# EAGLE design CurrentSenseMXChip (EAGLE 9.3.2)
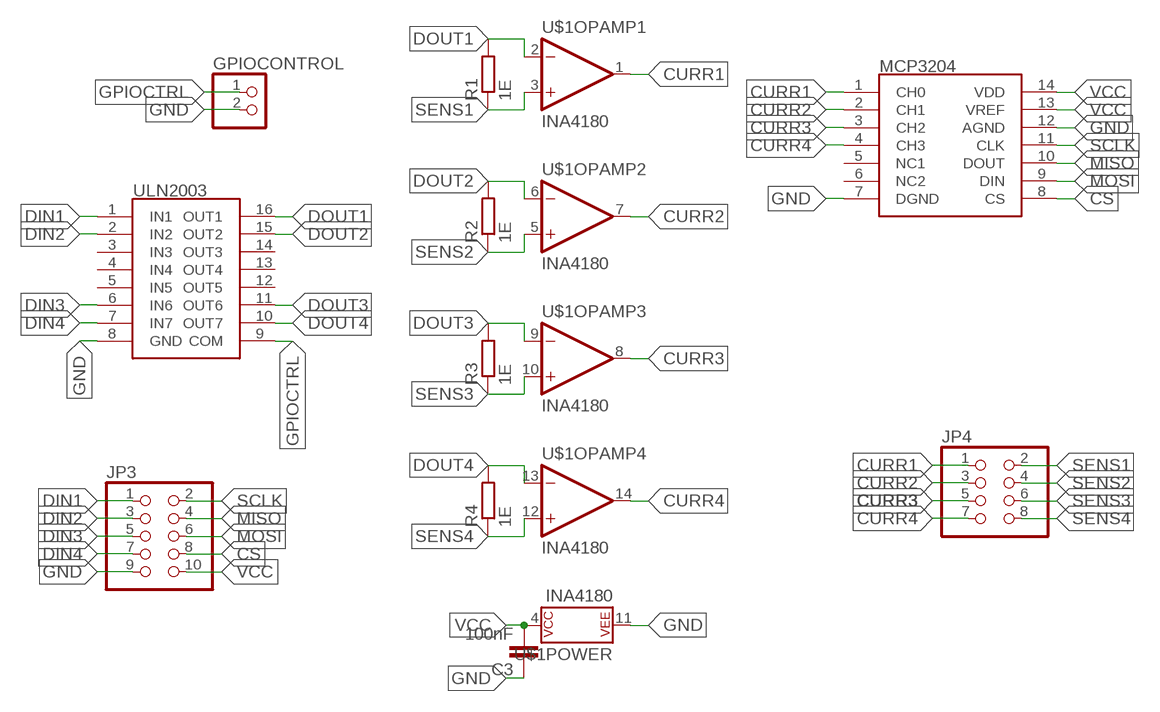
[diagram p0: schematic, sheet 1]

## Parts
C3  100nF  C-EUC1206  [C1206]
GPIOCONTROL  PINHD-1X2  [1X02]
JP3  PINHD-2X5  [2X05]
JP4  PINHD-2X4  [2X04]
R1  1E  R-EU_R1206  [R1206]
R2  1E  R-EU_R1206  [R1206]
R3  1E  R-EU_R1206  [R1206]
R4  1E  R-EU_R1206  [R1206]
U$1  INA4180  [TSSOP-14]
U$2  ULN2003  [SO16]
U$3  MCP3204  [TSSOP-14]

## Nets
CS: JP3.8 U$3.8(CS)
CURR1: JP4.1 U$1.1(OPAMP1:OUT) U$3.1(CH0)
CURR2: JP4.3 U$1.7(OPAMP2:OUT) U$3.2(CH1)
CURR3: JP4.5 U$1.8(OPAMP3:OUT) U$3.3(CH2)
CURR4: JP4.7 U$1.14(OPAMP4:OUT) U$3.4(CH3)
DIN1: JP3.1 U$2.1(IN1)
DIN2: JP3.3 U$2.2(IN2)
DIN3: JP3.5 U$2.6(IN6)
DIN4: JP3.7 U$2.7(IN7)
DOUT1: R1.2 U$1.2(OPAMP1:-IN) U$2.16(OUT1)
DOUT2: R2.2 U$1.6(OPAMP2:-IN) U$2.15(OUT2)
DOUT3: R3.2 U$1.9(OPAMP3:-IN) U$2.11(OUT6)
DOUT4: R4.2 U$1.13(OPAMP4:-IN) U$2.10(OUT7)
GND: C3.1 GPIOCONTROL.2 JP3.9 U$1.11(POWER:P$V-) U$2.8(GND) U$3.7(DGND) U$3.12(AGND)
GPIOCTRL: GPIOCONTROL.1 U$2.9(COM)
MISO: JP3.4 U$3.10(DOUT)
MOSI: JP3.6 U$3.9(DIN)
SCLK: JP3.2 U$3.11(CLK)
SENS1: JP4.2 R1.1 U$1.3(OPAMP1:+IN)
SENS2: JP4.4 R2.1 U$1.5(OPAMP2:+IN)
SENS3: JP4.6 R3.1 U$1.10(OPAMP3:+IN)
SENS4: JP4.8 R4.1 U$1.12(OPAMP4:+IN)
VCC: C3.2 JP3.10 U$1.4(POWER:P$V+) U$3.13(VREF) U$3.14(VDD)
Unconnected: U$2.3(IN3) U$2.4(IN4) U$2.5(IN5) U$2.12(OUT5) U$2.13(OUT4) U$2.14(OUT3) U$3.5(NC1) U$3.6(NC2)

## Library data of the parts
C3 = resistor:C-EU: CAPACITOR, European symbol
GPIOCONTROL = pinhead:PINHD-1X2: PIN HEADER
JP3 = pinhead:PINHD-2X5: PIN HEADER
JP4 = pinhead:PINHD-2X4: PIN HEADER
R1-R4 = resistor:R-EU_: RESISTOR, European symbol
U$1 = SparkFun-IC-Amplifiers:INA4180
U$2 = SparkFun-IC-Amplifiers:ULN2003
U$3 = SparkFun-IC-Amplifiers-1:MCP3204

## Board
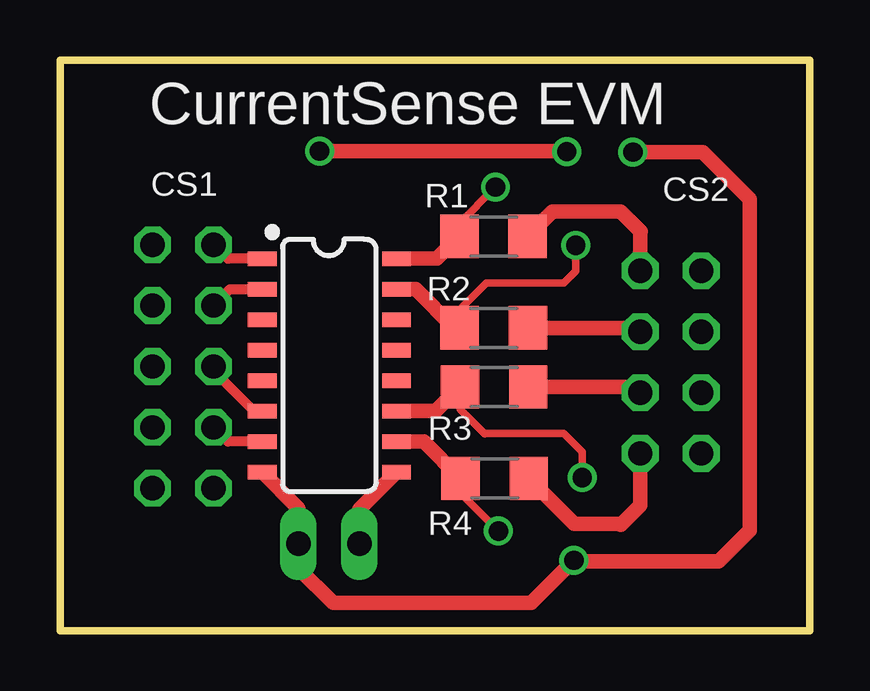
[diagram p1: board, top side]
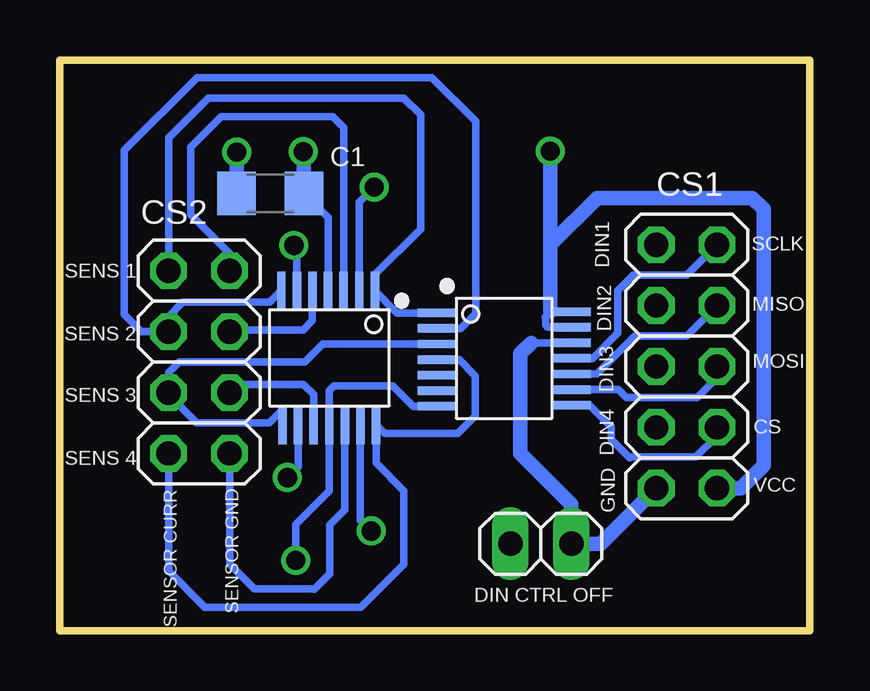
[diagram p2: board, bottom side, seen from below]

Size 31.24 x 23.81 mm. Coordinates in mm from the lower left corner, seen from the top.
Outline: 0,0.02 0,23.8 31.24,23.81 31.24,0 0,0
Copper layers (1*16): Top 0.035mm / dielectric 1.5mm / Bottom 0.035mm
Design rules "default *": minimum track width 8mil, minimum drill 8mil, track to track 24mil, track to pad 24mil, pad to pad 24mil, via to via 24mil, smd to smd 8mil, copper to edge 40mil, drill to drill 8mil, minimum pad ring 7mil, minimum via ring 8mil, stop-mask expansion 4mil, vias tented up to drill 0mil, thermal gap 10mil

### Footprints (pad centres in the part's own frame; a part is rotated, then mirrored left to right if it is on the bottom)
C1206 = smd 1.6 x 1.8: 1 -1.4,0; 2 1.4,0
1X02 = drill 1.016 long: 1 -1.27,0; 2 1.27,0
2X05 = drill 1.016 octagon: 1 -5.08,-1.27; 2 -5.08,1.27; 3 -2.54,-1.27; 4 -2.54,1.27; 5 0,-1.27; 6 0,1.27; 7 2.54,-1.27; 8 2.54,1.27; 9 5.08,-1.27; 10 5.08,1.27
2X04 = drill 1.016 octagon: 1 -3.81,-1.27; 2 -3.81,1.27; 3 -1.27,-1.27; 4 -1.27,1.27; 5 1.27,-1.27; 6 1.27,1.27; 7 3.81,-1.27; 8 3.81,1.27
R1206 = smd 1.6 x 1.803: 1 -1.422,0; 2 1.422,0
TSSOP-14 = smd 1.6 x 0.35: 1 -2.8,1.9; 2 -2.8,1.25; 3 -2.8,0.6; 4 -2.8,-0.05; 5 -2.8,-0.7; 6 -2.8,-1.35; 7 -2.8,-2; 8 2.8,-1.95; 9 2.8,-1.3; 10 2.8,-0.65; 11 2.8,0; 12 2.8,0.65; 13 2.8,1.3; 14 2.8,1.95
SO16 = smd 0.6 x 1.2: 1 -4.445,-2.8; 2 -3.175,-2.8; 3 -1.905,-2.8; 4 -0.635,-2.8; 5 0.635,-2.8; 6 1.905,-2.8; 7 3.175,-2.8; 8 4.445,-2.8; 9 4.445,2.8; 10 3.175,2.8; 11 1.905,2.8; 12 0.635,2.8; 13 -0.635,2.8; 14 -1.905,2.8; 15 -3.175,2.8; 16 -4.445,2.8

### Placement (x,y rotation side)
C3  22.48,18.25 0 bottom
GPIOCONTROL  11.2,3.64 0 bottom
JP3  5.13,11.03 270 bottom
JP4  25.45,11.21 270 bottom
R1  18.06,16.45 180 top
R2  18.07,12.64 180 top
R3  18.09,10.18 180 top
R4  18.11,6.36 180 top
U$1  20.02,11.39 270 bottom
U$2  11.22,11.08 270 top
U$3  12.73,11.37 0 bottom

### Tracks (layer width: path | path; a pad name or v marks a point on that pad's centre or on a via)
CS
  Bottom 0.305: JP3.8 3.86,8.14 4.75,7.25 7.47,7.25 7.5,7.23 8.27,8 8.27,8.51 9.18,9.42 U$3.8
CURR1
  Bottom 0.305: U$3.1 17.2,13.27 U$1.1 18.12,14.86 16.22,16.77 16.22,21.52 16.92,22.22 25.07,22.22 26.72,20.58 JP4.1
CURR2
  Bottom 0.305: U$1.7 22.5,13.71 26.12,13.71 26.72,13.11 JP4.3 27.85,12.48 28.56,13.19 28.56,20.04 25.52,23.08 15.75,23.08 13.92,21.25 13.92,13.24 14.54,12.62 U$3.2
CURR3
  Bottom 0.305: U$1.8 21.97,9.15 22.01,9.19 22.53,8.67 25.53,8.67 26.72,9.86 JP4.5 26.72,10.78 26.28,11.22 21.04,11.22 20.29,11.97 U$3.3
CURR4
  Bottom 0.305: U$3.4 14.61,11.32 13.93,10.64 13.93,8.96 14.67,8.23 17.72,8.23 U$1.14 18.07,7.01 16.91,5.85 16.91,2.78 18.71,0.99 25.21,0.99 26.72,2.5 JP4.7
DIN1
  Top 0.406: U$2.1 6.99,15.52 JP3.1
DIN2
  Top 0.406: JP3.3 7.08,14.25 U$2.2
DIN3
  Top 0.406: U$2.6 8.07,9.17 6.4,10.84 JP3.5
DIN4
  Top 0.406: U$2.7 6.99,7.9 JP3.7
DOUT1  (via drill 0.8)
  Top 0.305: v18.15,18.51 16.64,17 R1.2
  Top 0.61: R1.2 15.7,15.52 U$2.16
  Bottom 0.305: U$1.2 18.77,17.88 v18.15,18.51
DOUT2  (via drill 0.8)
  Top 0.305: v21.49,16.08 21.49,15.01 21,14.51 17.76,14.51 16.65,13.4 R2.2
  Top 0.61: U$2.15 14.82,14.25 16.42,12.64 R2.2
  Bottom 0.305: U$1.6 21.37,15.96 v21.49,16.08
DOUT3  (via drill 0.8)
  Top 0.305: v21.76,6.4 21.76,7.47 21,8.24 17.72,8.24 17.7,8.22 16.68,9.24 16.68,10.16
  Top 0.61: U$2.11 15.66,9.17 R3.2 16.68,10.16
  Bottom 0.305: U$1.9 21.32,6.84 v21.76,6.4
DOUT4  (via drill 0.8)
  Top 0.305: R4.2 16.69,5.75 v18.27,4.17
  Top 0.61: U$2.10 15.15,7.9 R4.2
  Bottom 0.305: U$1.13 18.72,4.62 v18.27,4.17
GND  (via drill 0.8)
  Top 0.61: U$2.8 9.93,5.12 GPIOCONTROL.2 9.93,2.61 11.38,1.17 19.63,1.17 v21.42,2.95 21.46,2.9 27.45,2.9 28.74,4.19 28.74,18.01 26.79,19.96 v23.87,19.96
  Bottom 0.305: U$3.7 16.53,9.37 17.37,10.21 19.84,10.21 20.02,10.02 U$1.11 20.02,5.85 21.42,4.46 v21.42,2.95 | U$3.12 11.6,12.02
  Bottom 0.61: JP3.9 8.71,3.64 GPIOCONTROL.2 9.93,5.28 12.05,7.4 12.05,11.56 11.6,12.02 | v23.87,19.96 C3.1
GPIOCTRL
  Top 0.61: U$2.9 12.47,5.08 GPIOCONTROL.1
MISO
  Bottom 0.305: JP3.4 5.12,12.31 7.29,12.31 8.88,10.72 U$3.10
MOSI
  Bottom 0.305: JP3.6 3.86,10.57 4.69,9.73 7.64,9.73 7.98,10.07 U$3.9
SCLK
  Bottom 0.305: JP3.2 5.13,14.84 7.36,14.84 8,14.2 8,12.42 9.05,11.37 U$3.11
SENS1
  Top 0.61: R1.1 20.52,17.48 23.36,17.48 24.2,16.65 24.18,16.63 JP4.2
  Bottom 0.305: U$1.3 19.42,20.99 19.87,21.44 24.52,21.44 25.8,20.17 25.8,17.36 24.18,15.74 JP4.2
SENS2
  Top 0.61: R2.1 24.02,12.64 JP4.4
  Bottom 0.305: U$1.5 20.72,12.94 21.11,12.56 24.1,12.56 JP4.4
SENS3
  Top 0.61: R3.1 23.94,10.18 JP4.6
  Bottom 0.305: U$1.10 20.67,9.86 21.1,10.29 23.84,10.29 JP4.6
SENS4
  Top 0.61: R4.1 21.42,4.47 23.32,4.47 23.36,4.42 24.18,5.24 JP4.8
  Bottom 0.305: U$1.12 19.37,5.06 20.01,4.42 20.01,2.39 20.65,1.75 20.66,1.76 23.15,1.76 24.18,2.78 JP4.8
VCC  (via drill 0.8)
  Top 0.61: v10.82,20.01 21.09,20.01 v21.11,19.99
  Bottom 0.305: U$3.13 10.93,12.67 11.01,12.75 11.01,13.08 11.02,13.09 10.79,13.32 10.79,13.34 9.95,13.34 U$3.14 | U$1.4 20.07,17.24 C3.2
  Bottom 0.61: JP3.10 2.88,5.95 1.91,6.91 1.91,17.58 2.39,18.06 8.85,18.06 10.81,16.11 | 10.81,16.11 10.81,13.35 10.79,13.34 | v21.11,19.99 21.08,19.96 C3.2 | v10.82,20.01 10.81,20 10.81,16.11

### Text on the board
tPlace: CS1 | R1 | CS2 | R2 | R3 | R4
bPlace: C1 | CS1 | CS2
tNames: CurrentSense EVM
bNames: DIN1 | SCLK | SENS 1 | DIN2 | MISO | DIN3 | SENS 2 | MOSI | SENS 3 | DIN4 | CS | GND | SENS 4 | VCC | SENSOR GND | SENSOR CURR | DIN CTRL OFF